# Altium schematic sheet Main.SchDoc
size A3
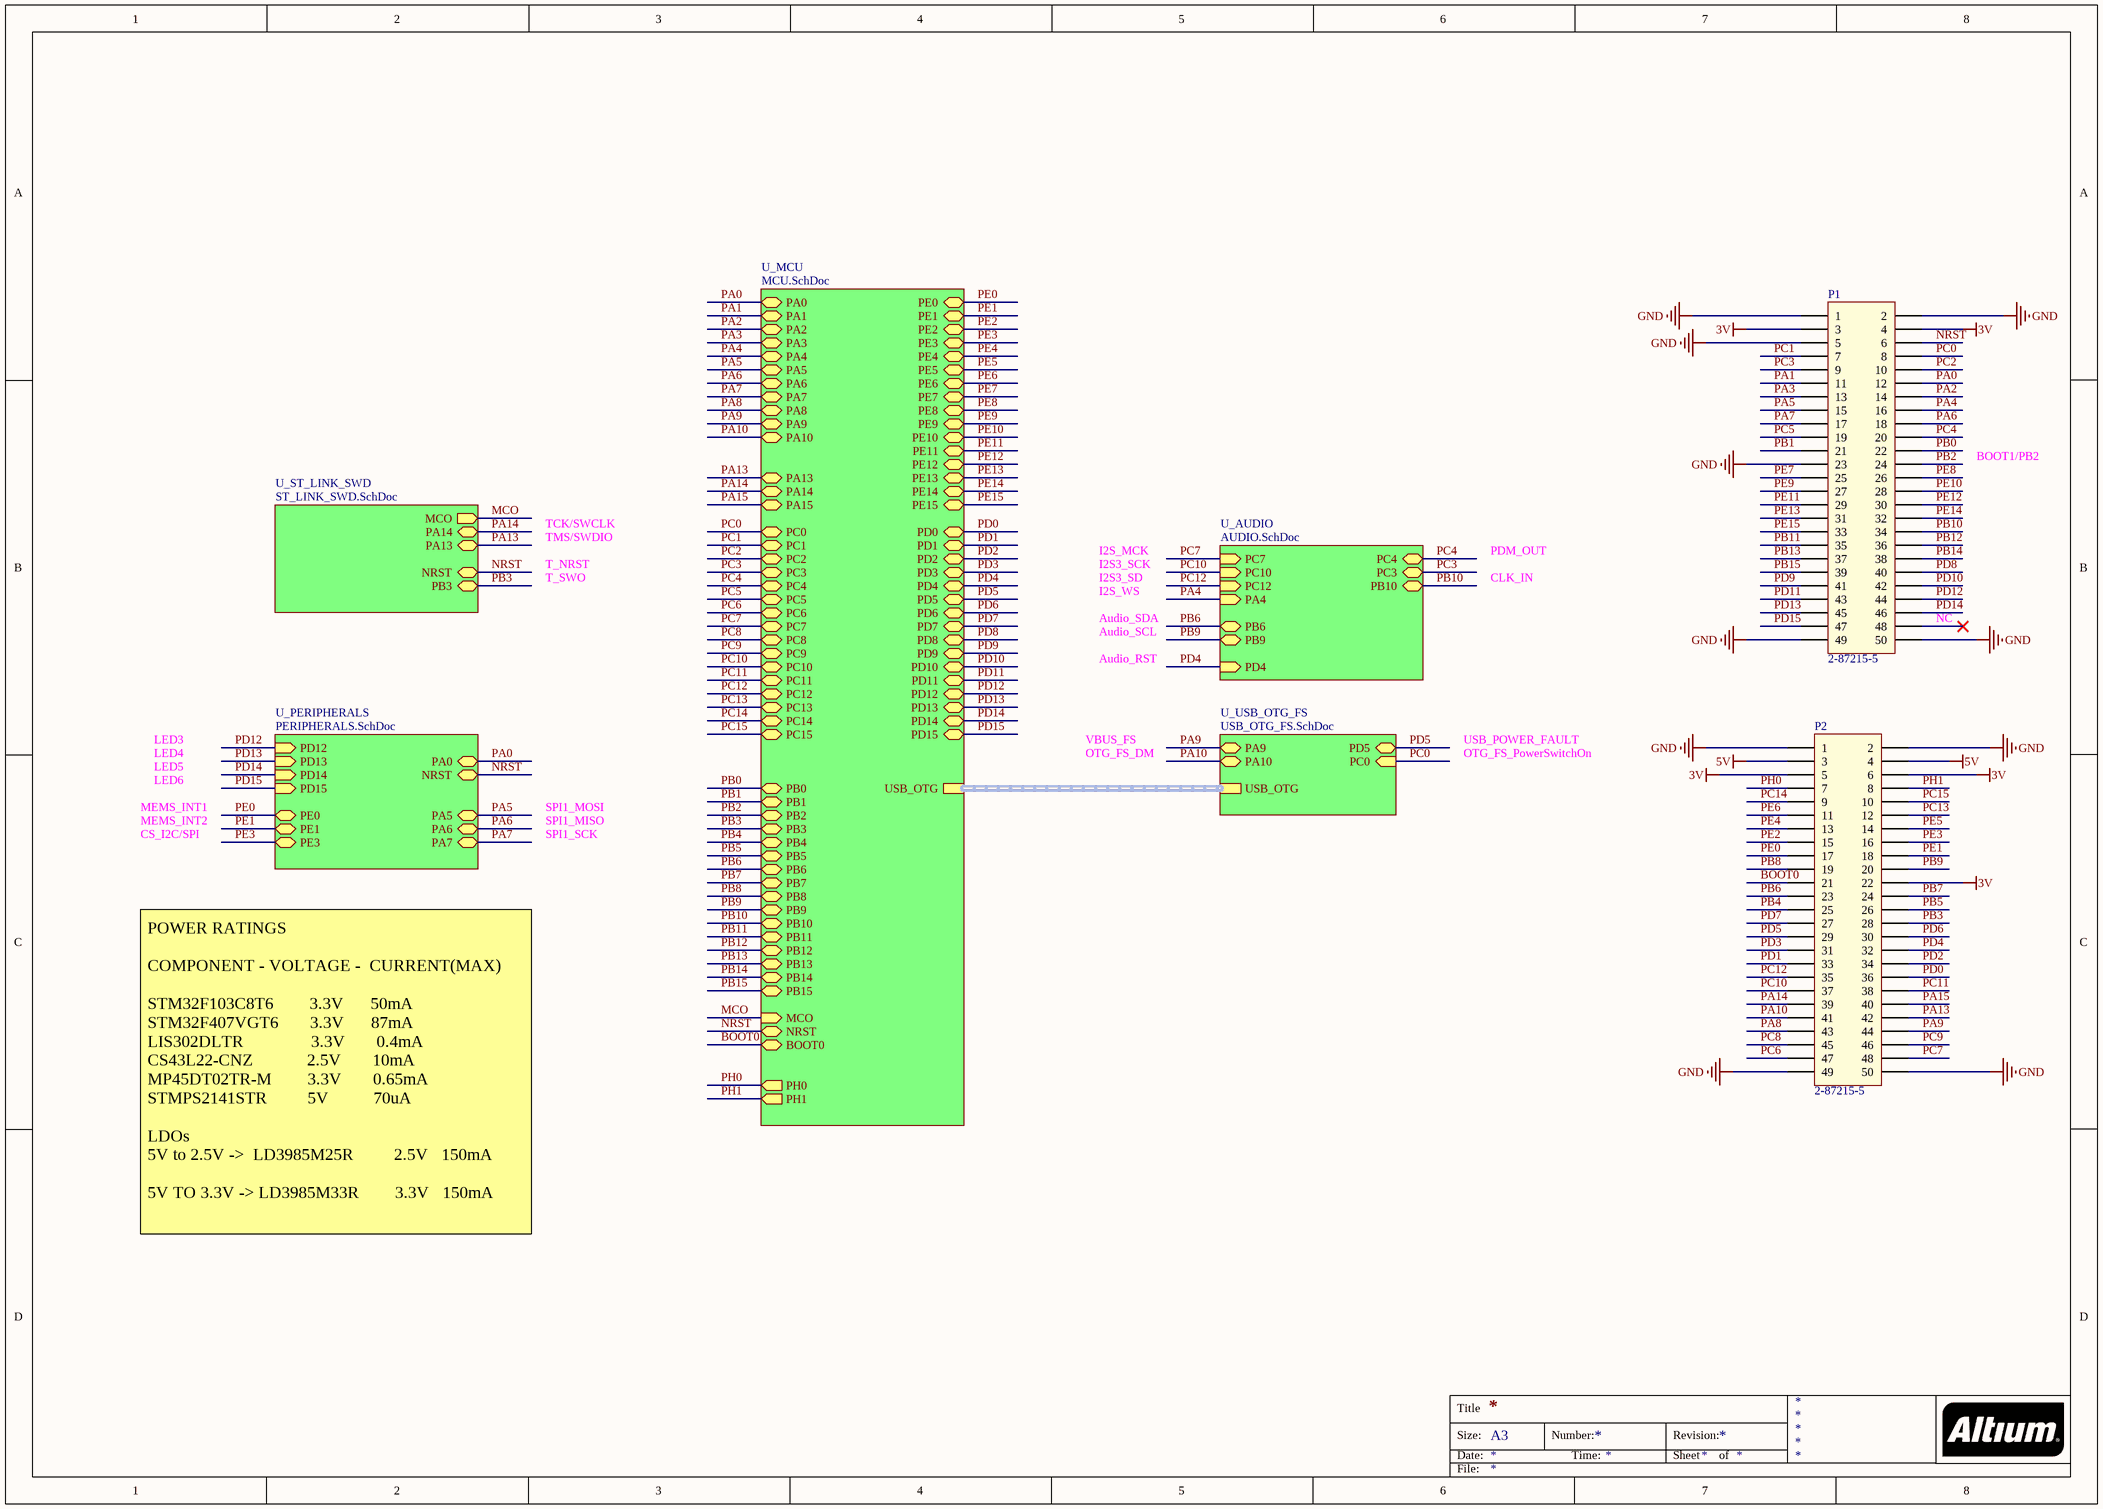
[diagram p0: Main.SchDoc]

## Parts
P1  2-87215-5  [HEADER 25x2]
P2  2-87215-5  [HEADER 25x2]

## Sub-sheets
U_AUDIO = AUDIO.SchDoc: PC4 (bidir), PC3 (bidir), PB10 (bidir), PB9 (bidir), PB6 (bidir), PC7 (in), PC10 (in), PC12 (in), PA4 (in), PD4 (in)
U_MCU = MCU.SchDoc: PA0 (bidir), PA1 (bidir), PA2 (bidir), PA3 (bidir), PA4 (bidir), PA5 (bidir), PA6 (bidir), PA7 (bidir), PA8 (bidir), PA9 (bidir), PA10 (bidir), PA13 (bidir), PA14 (bidir), PA15 (bidir), PE0 (bidir), PE1 (bidir), PE2 (bidir), PE3 (bidir), PE4 (bidir), PE5 (bidir), PE6 (bidir), PE7 (bidir), PE8 (bidir), PE9 (bidir), PE10 (bidir), PE11 (bidir), PE12 (bidir), PE13 (bidir), PE14 (bidir), PE15 (bidir), PC15 (bidir), PC14 (bidir), PC0 (bidir), PC1 (bidir), PC2 (bidir), PC3 (bidir), PC4 (bidir), PC5 (bidir), PC6 (bidir), PC7 (bidir), PC8 (bidir), PC9 (bidir), PC10 (bidir), PC11 (bidir), PC12 (bidir), PC13 (bidir), PB0 (bidir), PB1 (bidir), PB2 (bidir), PB3 (bidir), PB4 (bidir), PB5 (bidir), PB6 (bidir), PB7 (bidir), PB8 (bidir), PB9 (bidir), PB10 (bidir), PB11 (bidir), PB12 (bidir), PB13 (bidir), PB14 (bidir), PB15 (bidir), MCO (in), NRST (bidir), BOOT0 (bidir), PH0 (out), PH1 (out), PD0 (bidir), PD1 (bidir), PD2 (bidir), PD3 (bidir), PD4 (bidir), PD5 (bidir), PD6 (bidir), PD7 (bidir), PD8 (bidir), PD9 (bidir), PD10 (bidir), PD11 (bidir), PD12 (bidir), PD13 (bidir), PD14 (bidir), PD15 (bidir), USB_OTG (harness USB_OTG)
U_PERIPHERALS = PERIPHERALS.SchDoc: NRST (bidir), PD12 (in), PD13 (in), PD14 (in), PD15 (in), PA7 (bidir), PA5 (bidir), PE0 (bidir), PE1 (bidir), PE3 (bidir), PA6 (bidir), PA0 (bidir)
U_ST_LINK_SWD = ST_LINK_SWD.SchDoc: MCO (out), PA14 (bidir), PA13 (bidir), NRST (bidir), PB3 (bidir)
U_USB_OTG_FS = USB_OTG_FS.SchDoc: PA9 (bidir), PA10 (bidir), PC0 (in), PD5 (bidir), USB_OTG (harness USB_OTG)

## Nets
3V: P1.3 P1.4 P2.5 P2.6 P2.22
5V: P2.3 P2.4
GND: P1.1 P1.2 P1.5 P1.23 P1.49 P1.50 P2.1 P2.2 P2.49 P2.50
BOOT0: P2.21 ; sheet U_MCU/BOOT0
MCO: sheet U_ST_LINK_SWD/MCO, sheet U_MCU/MCO
NRST: P1.6 ; sheet U_ST_LINK_SWD/NRST, sheet U_MCU/NRST, sheet U_PERIPHERALS/NRST
PA0: P1.12 ; sheet U_MCU/PA0, sheet U_PERIPHERALS/PA0
PA1: P1.11 ; sheet U_MCU/PA1
PA2: P1.14 ; sheet U_MCU/PA2
PA3: P1.13 ; sheet U_MCU/PA3
PA4: P1.16 ; sheet U_AUDIO/PA4, sheet U_MCU/PA4
PA5: P1.15 ; sheet U_MCU/PA5, sheet U_PERIPHERALS/PA5
PA6: P1.18 ; sheet U_MCU/PA6, sheet U_PERIPHERALS/PA6
PA7: P1.17 ; sheet U_MCU/PA7, sheet U_PERIPHERALS/PA7
PA8: P2.43 ; sheet U_MCU/PA8
PA9: P2.44 ; sheet U_USB_OTG_FS/PA9, sheet U_MCU/PA9
PA10: P2.41 ; sheet U_USB_OTG_FS/PA10, sheet U_MCU/PA10
PA13: P2.42 ; sheet U_ST_LINK_SWD/PA13, sheet U_MCU/PA13
PA14: P2.39 ; sheet U_ST_LINK_SWD/PA14, sheet U_MCU/PA14
PA15: P2.40 ; sheet U_MCU/PA15
PB0: P1.22 ; sheet U_MCU/PB0
PB1: P1.21 ; sheet U_MCU/PB1
PB2: P1.24 ; sheet U_MCU/PB2
PB3: P2.28 ; sheet U_ST_LINK_SWD/PB3, sheet U_MCU/PB3
PB4: P2.25 ; sheet U_MCU/PB4
PB5: P2.26 ; sheet U_MCU/PB5
PB6: P2.23 ; sheet U_AUDIO/PB6, sheet U_MCU/PB6
PB7: P2.24 ; sheet U_MCU/PB7
PB8: P2.19 ; sheet U_MCU/PB8
PB9: P2.20 ; sheet U_AUDIO/PB9, sheet U_MCU/PB9
PB10: P1.34 ; sheet U_AUDIO/PB10, sheet U_MCU/PB10
PB11: P1.35 ; sheet U_MCU/PB11
PB12: P1.36 ; sheet U_MCU/PB12
PB13: P1.37 ; sheet U_MCU/PB13
PB14: P1.38 ; sheet U_MCU/PB14
PB15: P1.39 ; sheet U_MCU/PB15
PC0: P1.8 ; sheet U_USB_OTG_FS/PC0, sheet U_MCU/PC0
PC1: P1.7 ; sheet U_MCU/PC1
PC2: P1.10 ; sheet U_MCU/PC2
PC3: P1.9 ; sheet U_AUDIO/PC3, sheet U_MCU/PC3
PC4: P1.20 ; sheet U_AUDIO/PC4, sheet U_MCU/PC4
PC5: P1.19 ; sheet U_MCU/PC5
PC6: P2.47 ; sheet U_MCU/PC6
PC7: P2.48 ; sheet U_AUDIO/PC7, sheet U_MCU/PC7
PC8: P2.45 ; sheet U_MCU/PC8
PC9: P2.46 ; sheet U_MCU/PC9
PC10: P2.37 ; sheet U_AUDIO/PC10, sheet U_MCU/PC10
PC11: P2.38 ; sheet U_MCU/PC11
PC12: P2.35 ; sheet U_AUDIO/PC12, sheet U_MCU/PC12
PC13: P2.12 ; sheet U_MCU/PC13
PC14: P2.9 ; sheet U_MCU/PC14
PC15: P2.10 ; sheet U_MCU/PC15
PD0: P2.36 ; sheet U_MCU/PD0
PD1: P2.33 ; sheet U_MCU/PD1
PD2: P2.34 ; sheet U_MCU/PD2
PD3: P2.31 ; sheet U_MCU/PD3
PD4: P2.32 ; sheet U_AUDIO/PD4, sheet U_MCU/PD4
PD5: P2.29 ; sheet U_USB_OTG_FS/PD5, sheet U_MCU/PD5
PD6: P2.30 ; sheet U_MCU/PD6
PD7: P2.27 ; sheet U_MCU/PD7
PD8: P1.40 ; sheet U_MCU/PD8
PD9: P1.41 ; sheet U_MCU/PD9
PD10: P1.42 ; sheet U_MCU/PD10
PD11: P1.43 ; sheet U_MCU/PD11
PD12: P1.44 ; sheet U_MCU/PD12, sheet U_PERIPHERALS/PD12
PD13: P1.45 ; sheet U_MCU/PD13, sheet U_PERIPHERALS/PD13
PD14: P1.46 ; sheet U_MCU/PD14, sheet U_PERIPHERALS/PD14
PD15: P1.47 ; sheet U_MCU/PD15, sheet U_PERIPHERALS/PD15
PE0: P2.17 ; sheet U_MCU/PE0, sheet U_PERIPHERALS/PE0
PE1: P2.18 ; sheet U_MCU/PE1, sheet U_PERIPHERALS/PE1
PE2: P2.15 ; sheet U_MCU/PE2
PE3: P2.16 ; sheet U_MCU/PE3, sheet U_PERIPHERALS/PE3
PE4: P2.13 ; sheet U_MCU/PE4
PE5: P2.14 ; sheet U_MCU/PE5
PE6: P2.11 ; sheet U_MCU/PE6
PE7: P1.25 ; sheet U_MCU/PE7
PE8: P1.26 ; sheet U_MCU/PE8
PE9: P1.27 ; sheet U_MCU/PE9
PE10: P1.28 ; sheet U_MCU/PE10
PE11: P1.29 ; sheet U_MCU/PE11
PE12: P1.30 ; sheet U_MCU/PE12
PE13: P1.31 ; sheet U_MCU/PE13
PE14: P1.32 ; sheet U_MCU/PE14
PE15: P1.33 ; sheet U_MCU/PE15
PH0: P2.7 ; sheet U_MCU/PH0
PH1: P2.8 ; sheet U_MCU/PH1

Not connected (* = marked no-connect by the designer): P1 48*

## Buses and harness runs
harness sheet U_MCU/USB_OTG = sheet U_USB_OTG_FS/USB_OTG

## Notes on the sheet
- BOOT1/PB2
- TCK/SWCLK
- TMS/SWDIO
- T_NRST
- T_SWO
- I2S_MCK
- I2S3_SCK
- I2S3_SD
- PDM_OUT
- CLK_IN
- Audio_SDA
- Audio_SCL
- I2S_WS
- (near P1) NC
- Audio_RST
- LED3
- LED4
- LED5
- LED6
- VBUS_FS
- OTG_FS_DM
- OTG_FS_PowerSwitchOn
- USB_POWER_FAULT
- MEMS_INT1
- MEMS_INT2
- CS_I2C/SPI
- SPI1_MOSI
- SPI1_SCK
- SPI1_MISO
- POWER RATINGS
  COMPONENT - VOLTAGE -  CURRENT(MAX)
  STM32F103C8T6        3.3V      50mA
  STM32F407VGT6       3.3V      87mA
  LIS302DLTR               3.3V       0.4mA
  CS43L22-CNZ            2.5V       10mA
  MP45DT02TR-M        3.3V       0.65mA
  STMPS2141STR         5V          70uA
  LDOs
  5V to 2.5V ->  LD3985M25R         2.5V   150mA
  5V TO 3.3V -> LD3985M33R        3.3V   150mA
- Title
- Size:
- Date:
- A3
- Number:
- Time:
- Revision:
- Sheet
- of
- File:

## Library data of the parts
P1 P2 = 2-87215-5: Manufacturer: TE Connectivity (Tyco Electronics); Catalog Drawings: Dual Square Straight Posts / Dual Straight Posts Side; Featured Product: AMPMODU Connectors; 3D Model: 2-87215-5.pdf; Connector Type: Header, Unshrouded; Number of Positions: 50; Number of Positions Loaded: All; Pitch: 0.100" (2.54mm); Dynamic Catalog: AMPMODU Mod II Series; Mating Products: 2-147424-5-ND / - CONN RCPT 50POS VERT .100 T/H / 2-147104-5-ND / - CONN RCPT 50POS DUAL VERT SMD / 2-146762-6-ND / - CONN RCPT 50POS DL VERT .100 T/H / A32951-ND / - CONN RECEPT 50POS .100 VERT DUAL / 2-147095-5-ND / - CONN RECEPT ASMBLY DBL ROW 50POS / A26470-ND / - CONN RECEPT 50POS .100 VERT DUAL / 2-535542-5-ND / - CONN RECEPT 50POS .100 VERT DUAL / 2-86177-1-ND / - CONN RCPT HSNG 50POS DL CRIMP / A25825-ND / - CONN HOUSING 50POS .100 DUAL ROW / A3045-ND / - CONN HOUSING 50POS .100 DUAL; Other Names: 2-87215-5-ND / A26586; Supplier 1: Digikey; Manufacturer Part Number: 2-87215-5; Stock 1: 100; Pricing 1: 1=16.61, 10=15.422, 25=13.84, 50=13.4448, 100=11.863, 250=11.0721, 500=10.8349, 1000=10.2813 (USD); RoHS Information: 2-87215-5 Statement of Compliance; Standard Package: 100; Category: Connectors, Interconnects; Family: Rectangular Connectors - Headers, Male Pins; Series: AMPMODU Mod II; Contact Type: Male Pin; Number of Rows: 2; Row Spacing: 0.100" (2.54mm); Contact Mating Length: 0.318" (8.08mm); Mounting Type: Through Hole; Termination: Solder; Contact Finish: Gold; Contact Finish Thickness: 30µin (0.76µm); Color: Black; Packaging: Bulk; ComponentLink1URL: https://datasheet.ciiva.com/9478/eng-cs-1307819-section-5-0908-9478390.pdf; ComponentLink1Description: https://datasheet.ciiva.com/9478/eng-cs-1307819-section-5-0908-9478390.pdf; ComponentLink2URL: https://datasheet.ciiva.com/713/eng-cd-87215-j4-713258.pdf; ComponentLink2Description: https://datasheet.ciiva.com/713/eng-cd-87215-j4-713258.pdf